# Altium schematic sheet led.SchDoc
size A4
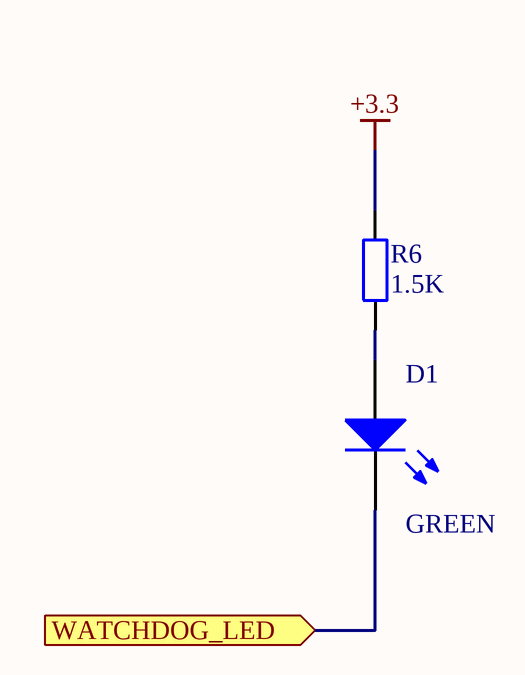
[diagram p0: led.SchDoc]

## Parts
D1  value GREEN  [LGQ971]
R6  value 1.5K  [R0603]  (hidden comment: Res)

## Ports
WATCHDOG_LED (in)

## Nets
+3.3: R6.2
WATCHDOG_LED: D1.2(K) ; port WATCHDOG_LED
NetD1_1: D1.1(A) R6.1

## Library data of the parts
D1 = LED2: Typical RED, GREEN, YELLOW, AMBER GaAs LED; farnell: 1226372
R6 = Res2: Resistor; farnell: 9330607